# EAGLE schematic Robotan (EAGLE 9.3.0)
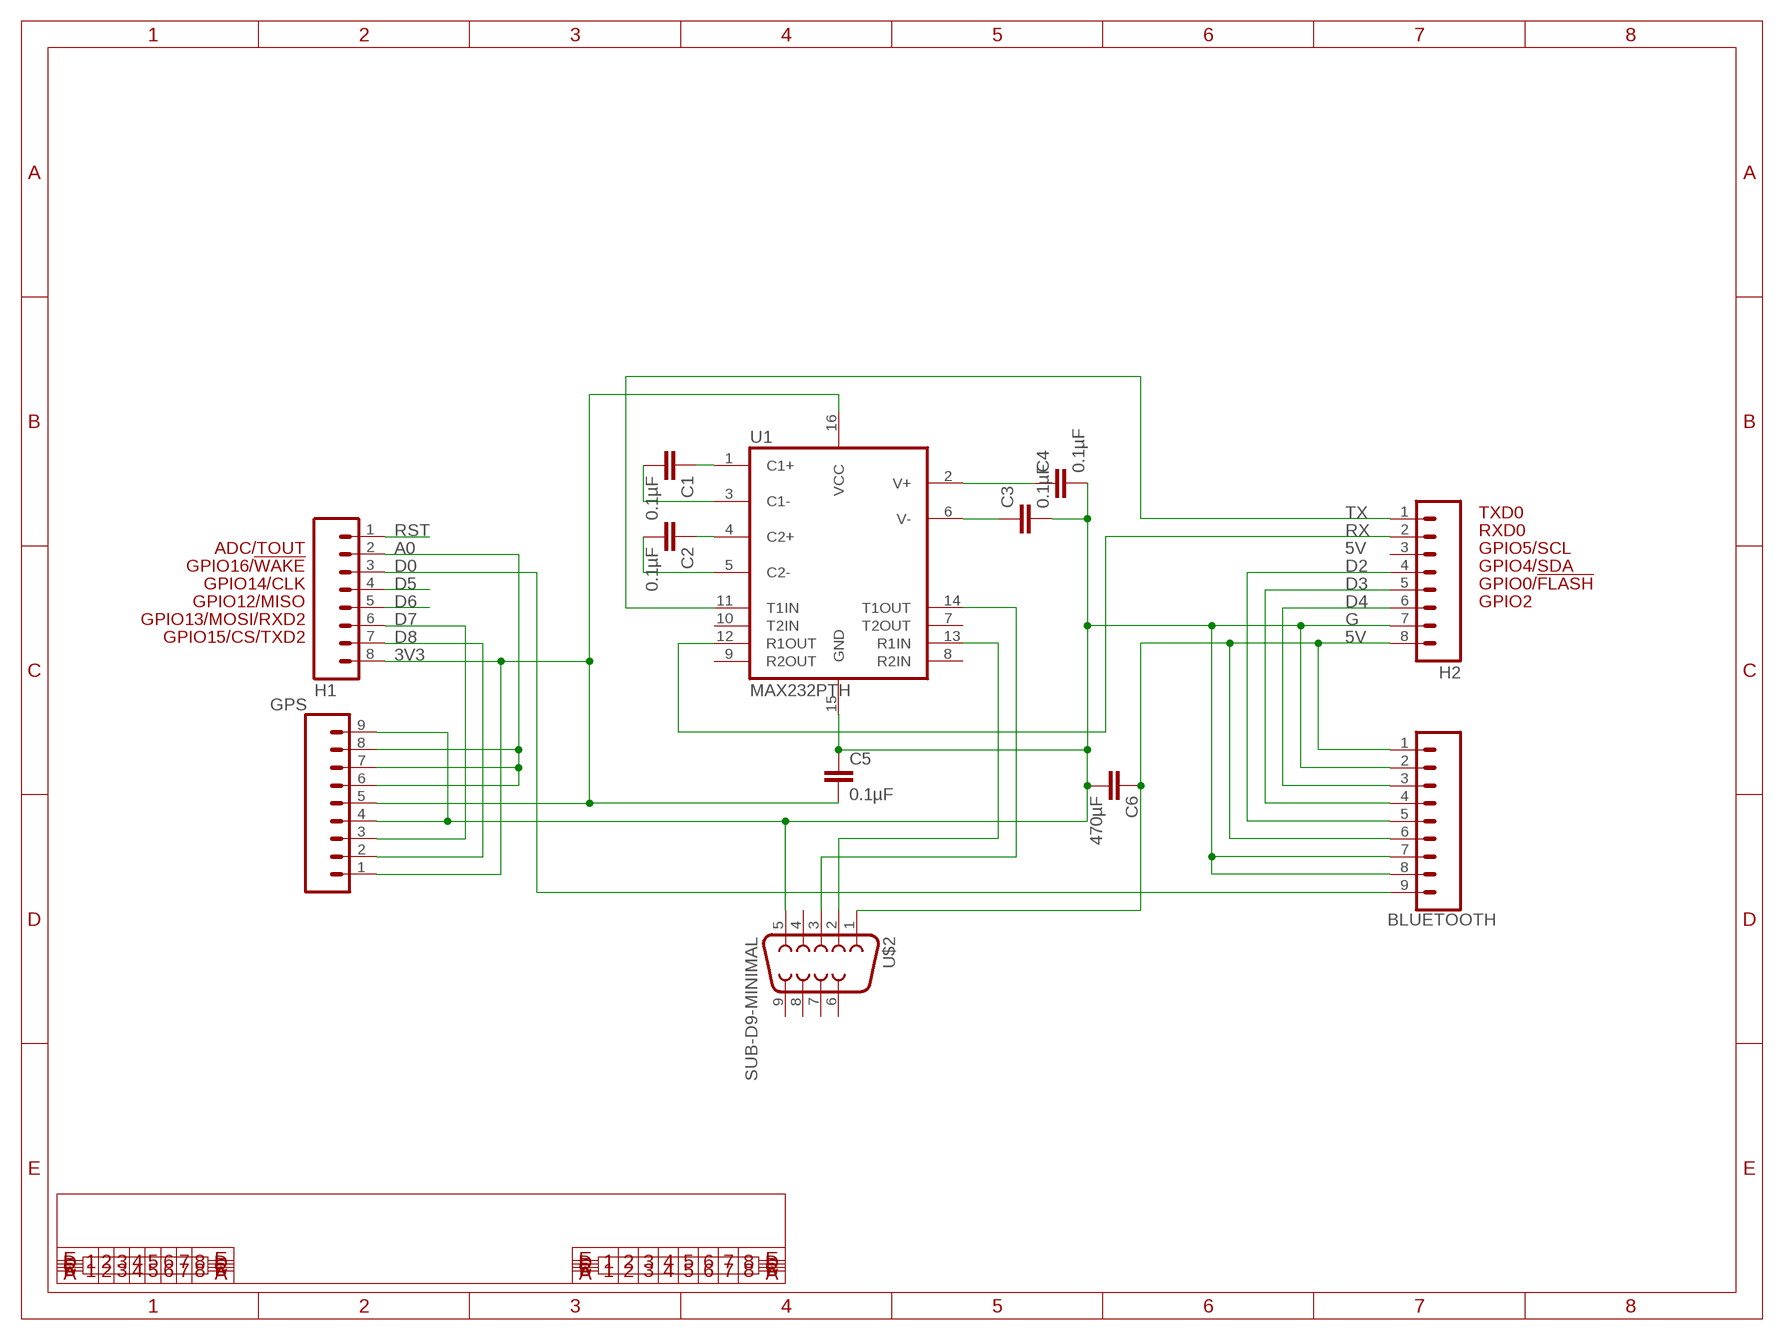
[diagram p0: schematic, sheet 1]

## Parts
BLUETOOTH  M09  [1X09]
C1  0.1µF  0.1UF-50V-20%(PTH)KIT-EZ  [CAP-PTH-SMALL-KIT]
C2  0.1µF  0.1UF-50V-20%(PTH)KIT-EZ  [CAP-PTH-SMALL-KIT]
C3  0.1µF  0.1UF-50V-20%(PTH)KIT-EZ  [CAP-PTH-SMALL-KIT]
C4  0.1µF  0.1UF-50V-20%(PTH)KIT-EZ  [CAP-PTH-SMALL-KIT]
C5  0.1µF  0.1UF-50V-20%(PTH)KIT-EZ  [CAP-PTH-SMALL-KIT]
C6  470µF  0.1UF-50V-20%(PTH)KIT-EZ  [CAP-PTH-SMALL-KIT]
GPS  M09  [1X09]
H1  M08  [1X08]
H2  M08  [1X08]
U1  MAX232PTH  [DIL16]
U$2  SUB-D9-MINIMAL  [SUB-D9-MINIMAL]

## Nets
3V3: C5.2 GPS.1 GPS.5 H1.8 U1.16(VCC)
5V: BLUETOOTH.1 BLUETOOTH.6 C6.1 H2.8 U$2.1
A0: GPS.6 GPS.7 GPS.8 H1.2
C1+: C1.1 U1.1(C1+)
C1-: C1.2 U1.3(C1-)
C2+: C2.1 U1.4(C2+)
C2-: C2.2 U1.5(C2-)
D0: BLUETOOTH.9 H1.3
D2: BLUETOOTH.5 H2.4
D3: BLUETOOTH.4 H2.5
D4: BLUETOOTH.3 H2.6
D5: H1.4
D6: H1.5
D7: GPS.3 H1.6
D8: GPS.2 H1.7
G: BLUETOOTH.2 BLUETOOTH.7 BLUETOOTH.8 C3.2 C4.2 C5.1 C6.2 GPS.4 GPS.9 H2.7 U1.15(GND) U$2.5
RS232_RX: U1.14(T1OUT) U$2.3
RS232_TX: U1.13(R1IN) U$2.2
RST: H1.1
RX: H2.2 U1.12(R1OUT)
TX: H2.1 U1.11(T1IN)
V+: C4.1 U1.2(V+)
V-: C3.1 U1.6(V-)
Unconnected: H2.3 U1.7(T2OUT) U1.8(R2IN) U1.9(R2OUT) U1.10(T2IN) U$2.4 U$2.6 U$2.7 U$2.8 U$2.9

## Notes on the sheet
- TXD0
- RXD0
- ADC/TOUT | GPIO5/SCL
- GPIO16/!WAKE | GPIO4/SDA
- GPIO14/CLK | GPIO0/!FLASH
- GPIO12/MISO | GPIO2
- GPIO13/MOSI/RXD2
- GPIO15/CS/TXD2

## Library data of the parts
BLUETOOTH GPS = SparkFun-Connectors:M09: Header 9 Standard 9-pin 0.1" header. Use with straight break away headers (SKU : PRT-00116), right angle break away headers (PRT-00553), swiss pins (PRT-00743), machine pins (PRT-00117), and female headers (PRT-00115).
C1-C6 = SparkFun-Capacitors:0.1UF-50V-20%(PTH): CAP-08370; PROD_ID: CAP-08370
H1 H2 = freetronics-original:M08: Header 8 Standard 8-pin 0.1" header. Use with straight break away headers (SKU : PRT-00116), right angle break away headers (PRT-00553), swiss pins (PRT-00743), machine pins (PRT-00117), and female headers (PRT-00115).
U1 = SparkFun-DigitalIC:MAX232: RS232 Transceiver Very common IC. This is generically called 'MAX232', but works with the 3V equivalent MAX3232 generic ICs. Field tested and mother approved. Spark Fun Electronics SKU : COM-00316 (DIP) and COM-00589 (SMD)
U$2 = CODE-IT:SUB-D9-MINIMAL: Test

## Net classes
0 default: width 0.203 mm, drill 0.356 mm, clearance 0.152 mm
1 power: width 0.203 mm, clearance 0.152 mm